# EAGLE design Thermostat Schematic (EAGLE 8.6.0)

## Sheet 1 of 2
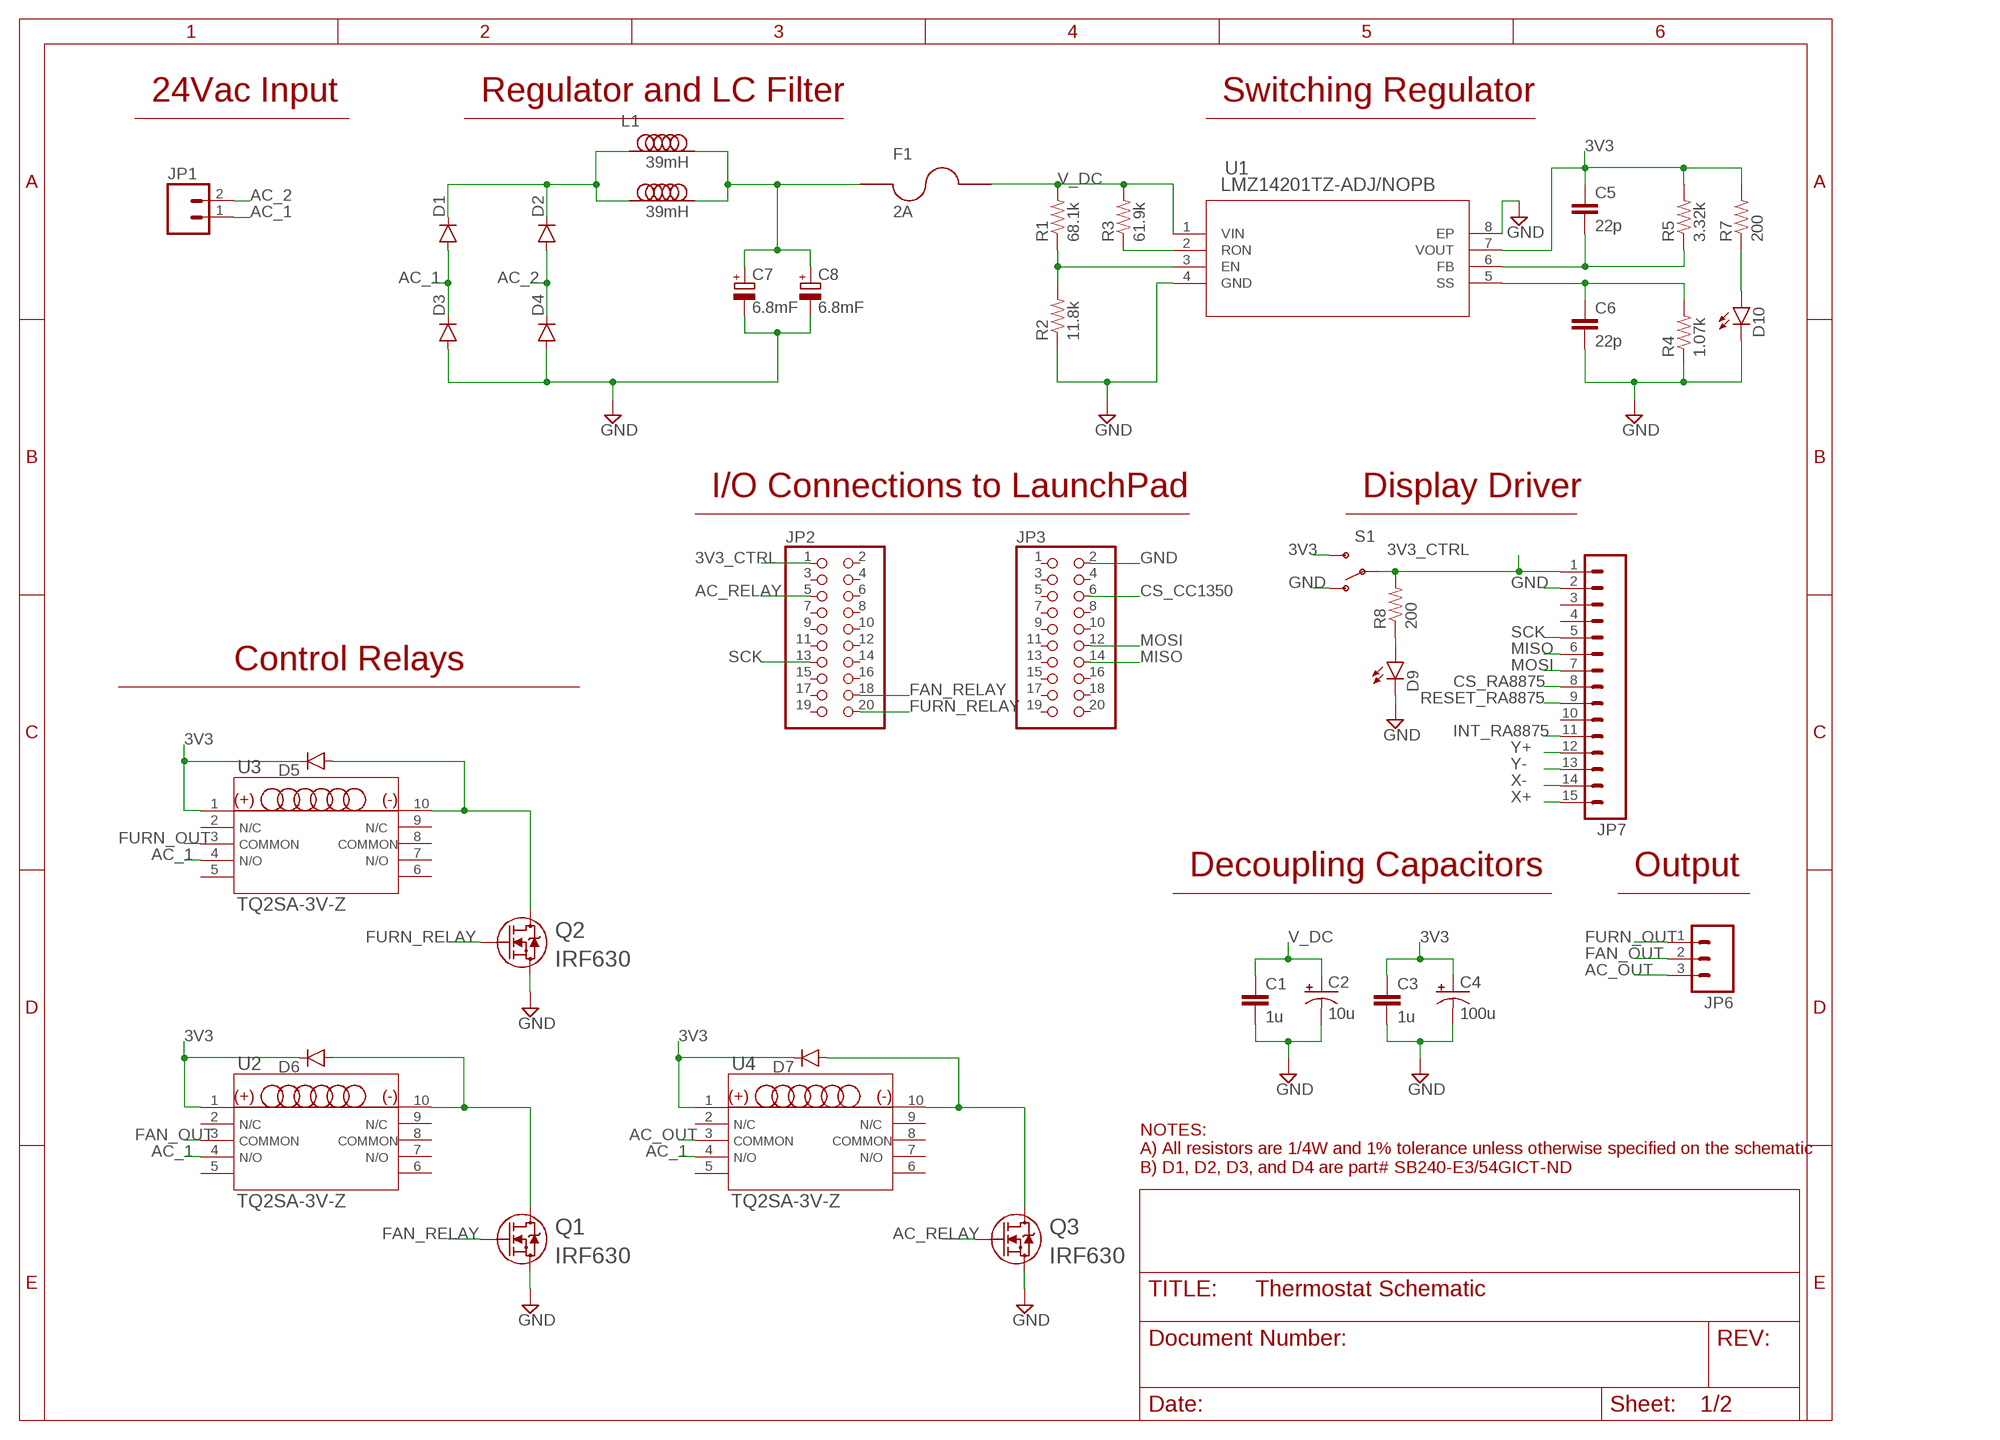
[diagram p0: schematic, sheet 1]

### Parts
C1  1u  CAPPTH1  [CAP-PTH-5MM]
C2  10u  CAP_POLPTH2  [CPOL-RADIAL-10UF-25V]
C3  1u  CAPPTH1  [CAP-PTH-5MM]
C4  100u  CAP_POLPTH4  [CPOL-RADIAL-1000UF-25V]
C5  22p  CAPPTH1  [CAP-PTH-5MM]
C6  22p  CAPPTH1  [CAP-PTH-5MM]
C7  6.8mF  CPOL-EUE7.5-16  [E7,5-16]
C8  6.8mF  CPOL-EUE7.5-16  [E7,5-16]
D1  DIODEPTH  [DIODE-1N4001]
D2  DIODEPTH  [DIODE-1N4001]
D3  DIODEPTH  [DIODE-1N4001]
D4  DIODEPTH  [DIODE-1N4001]
D5  DIODEPTH  [DIODE-1N4001]
D6  DIODEPTH  [DIODE-1N4001]
D7  DIODEPTH  [DIODE-1N4001]
D9  LED1206  [LED-1206]
D10  LED1206  [LED-1206]
F1  2A  FUSEHOLDER_36-3550-2-ND  [36-3550-2-ND]
JP1  M023.5MM  [SCREWTERMINAL-3.5MM-2]
JP2  PINHD-2X10  [2X10]
JP3  PINHD-2X10  [2X10]
JP6  M03SCREW  [SCREWTERMINAL-3.5MM-3]
JP7  M15  [1X15]
L1  39mH  B82733F  [B82733F]
Q1  IRF630  [TO-220]
Q2  IRF630  [TO-220]
Q3  IRF630  [TO-220]
R1  68.1k  RESISTORAXIAL-0.3  [AXIAL-0.3]
R2  11.8k  RESISTORAXIAL-0.3  [AXIAL-0.3]
R3  61.9k  RESISTORAXIAL-0.3  [AXIAL-0.3]
R4  1.07k  RESISTORAXIAL-0.3  [AXIAL-0.3]
R5  3.32k  RESISTORAXIAL-0.3  [AXIAL-0.3]
R7  200  RESISTORAXIAL-0.3  [AXIAL-0.3]
R8  200  RESISTORAXIAL-0.3  [AXIAL-0.3]
S1  SWITCH-SPDTPTH  [SWITCH-SPDT]
U1  LMZ14201TZ-ADJ/NOPB  [TZA07A]
U2  TQ2SA-3V-Z  TQ2SA-3V-ZRELAY_TQ2_SA-M  [RELAY_TQ2_SA-M]
U3  TQ2SA-3V-Z  TQ2SA-3V-ZRELAY_TQ2_SA-M  [RELAY_TQ2_SA-M]
U4  TQ2SA-3V-Z  TQ2SA-3V-ZRELAY_TQ2_SA-M  [RELAY_TQ2_SA-M]

### Nets
3V3: C3.1 C4.+ C5.1 D5.C D6.C D7.C R5.P$2 R7.P$2 S1.3(S) U1.7(VOUT) U2.1 U3.1 U4.1 ; also sheet 2
3V3_CTRL: JP2.1 JP7.1 R8.P$2 S1.2(P)
AC_1: D1.A D3.C JP1.1 U2.4 U3.4 U4.4
AC_2: D2.A D4.C JP1.2
AC_OUT: JP6.3 U4.3
AC_RELAY: JP2.5 Q3.1
CS_CC1350: JP3.6 ; also sheet 2
CS_RA8875: JP7.8 ; also sheet 2
FAN_OUT: JP6.2 U2.3
FAN_RELAY: JP2.18 Q1.1
FURN_OUT: JP6.1 U3.3
FURN_RELAY: JP2.20 Q2.1
GND: C1.2 C2.2(-) C3.2 C4.- C6.2 C7.- C8.- D3.A D4.A D9.C D10.C JP3.2 JP7.2 Q1.3 Q2.3 Q3.3 R2.P$1 R4.P$1 S1.1(O) U1.4(GND) U1.8(EP) ; also sheet 2
INT_RA8875: JP7.11 ; also sheet 2
MISO: JP3.14 JP7.6 ; also sheet 2
MOSI: JP3.12 JP7.7 ; also sheet 2
N$1: R1.P$1 R2.P$2 U1.3(EN)
N$2: R3.P$1 U1.2(RON)
N$3: C5.2 R5.P$1 U1.6(FB)
N$4: C6.1 R4.P$2 U1.5(SS)
N$5: D9.A R8.P$1
N$6: D1.C D2.C L1.P$1 L1.P$4
N$7: C7.+ C8.+ F1.PIN1A(PIN1) F1.PIN1B(PIN1) L1.P$2 L1.P$3
N$8: D10.A R7.P$1
N$9: D5.A Q2.2 U3.10
N$10: D6.A Q1.2 U2.10
N$11: D7.A Q3.2 U4.10
RESET_RA8875: JP7.9 ; also sheet 2
SCK: JP2.13 JP7.5 ; also sheet 2
V_DC: C1.1 C2.1(+) F1.PIN2A(PIN2) F1.PIN2B(PIN2) R1.P$2 R3.P$2 U1.1(VIN)
X+: JP7.15 ; also sheet 2
X-: JP7.14 ; also sheet 2
Y+: JP7.12 ; also sheet 2
Y-: JP7.13 ; also sheet 2
Unconnected: JP2.2 JP2.3 JP2.4 JP2.6 JP2.7 JP2.8 JP2.9 JP2.10 JP2.11 JP2.12 JP2.14 JP2.15 JP2.16 JP2.17 JP2.19 JP3.1 JP3.3 JP3.4 JP3.5 JP3.7 JP3.8 JP3.9 JP3.10 JP3.11 JP3.13 JP3.15 JP3.16 JP3.17 JP3.18 JP3.19 JP3.20 JP7.3 JP7.4 JP7.10 U2.2 U2.5 U2.6 U2.7 U2.8 U2.9 U3.2 U3.5 U3.6 U3.7 U3.8 U3.9 U4.2 U4.5 U4.6 U4.7 U4.8 U4.9

### Notes on the sheet
- 24Vac Input | Regulator and LC Filter | Switching Regulator
- I/O Connections to LaunchPad | Display Driver
- Control Relays
- Decoupling Capacitors | Output
- NOTES:
  A) All resistors are 1/4W and 1% tolerance unless otherwise specified on the schematic
  B) D1, D2, D3, and D4 are part# SB240-E3/54GICT-ND

## Sheet 2 of 2
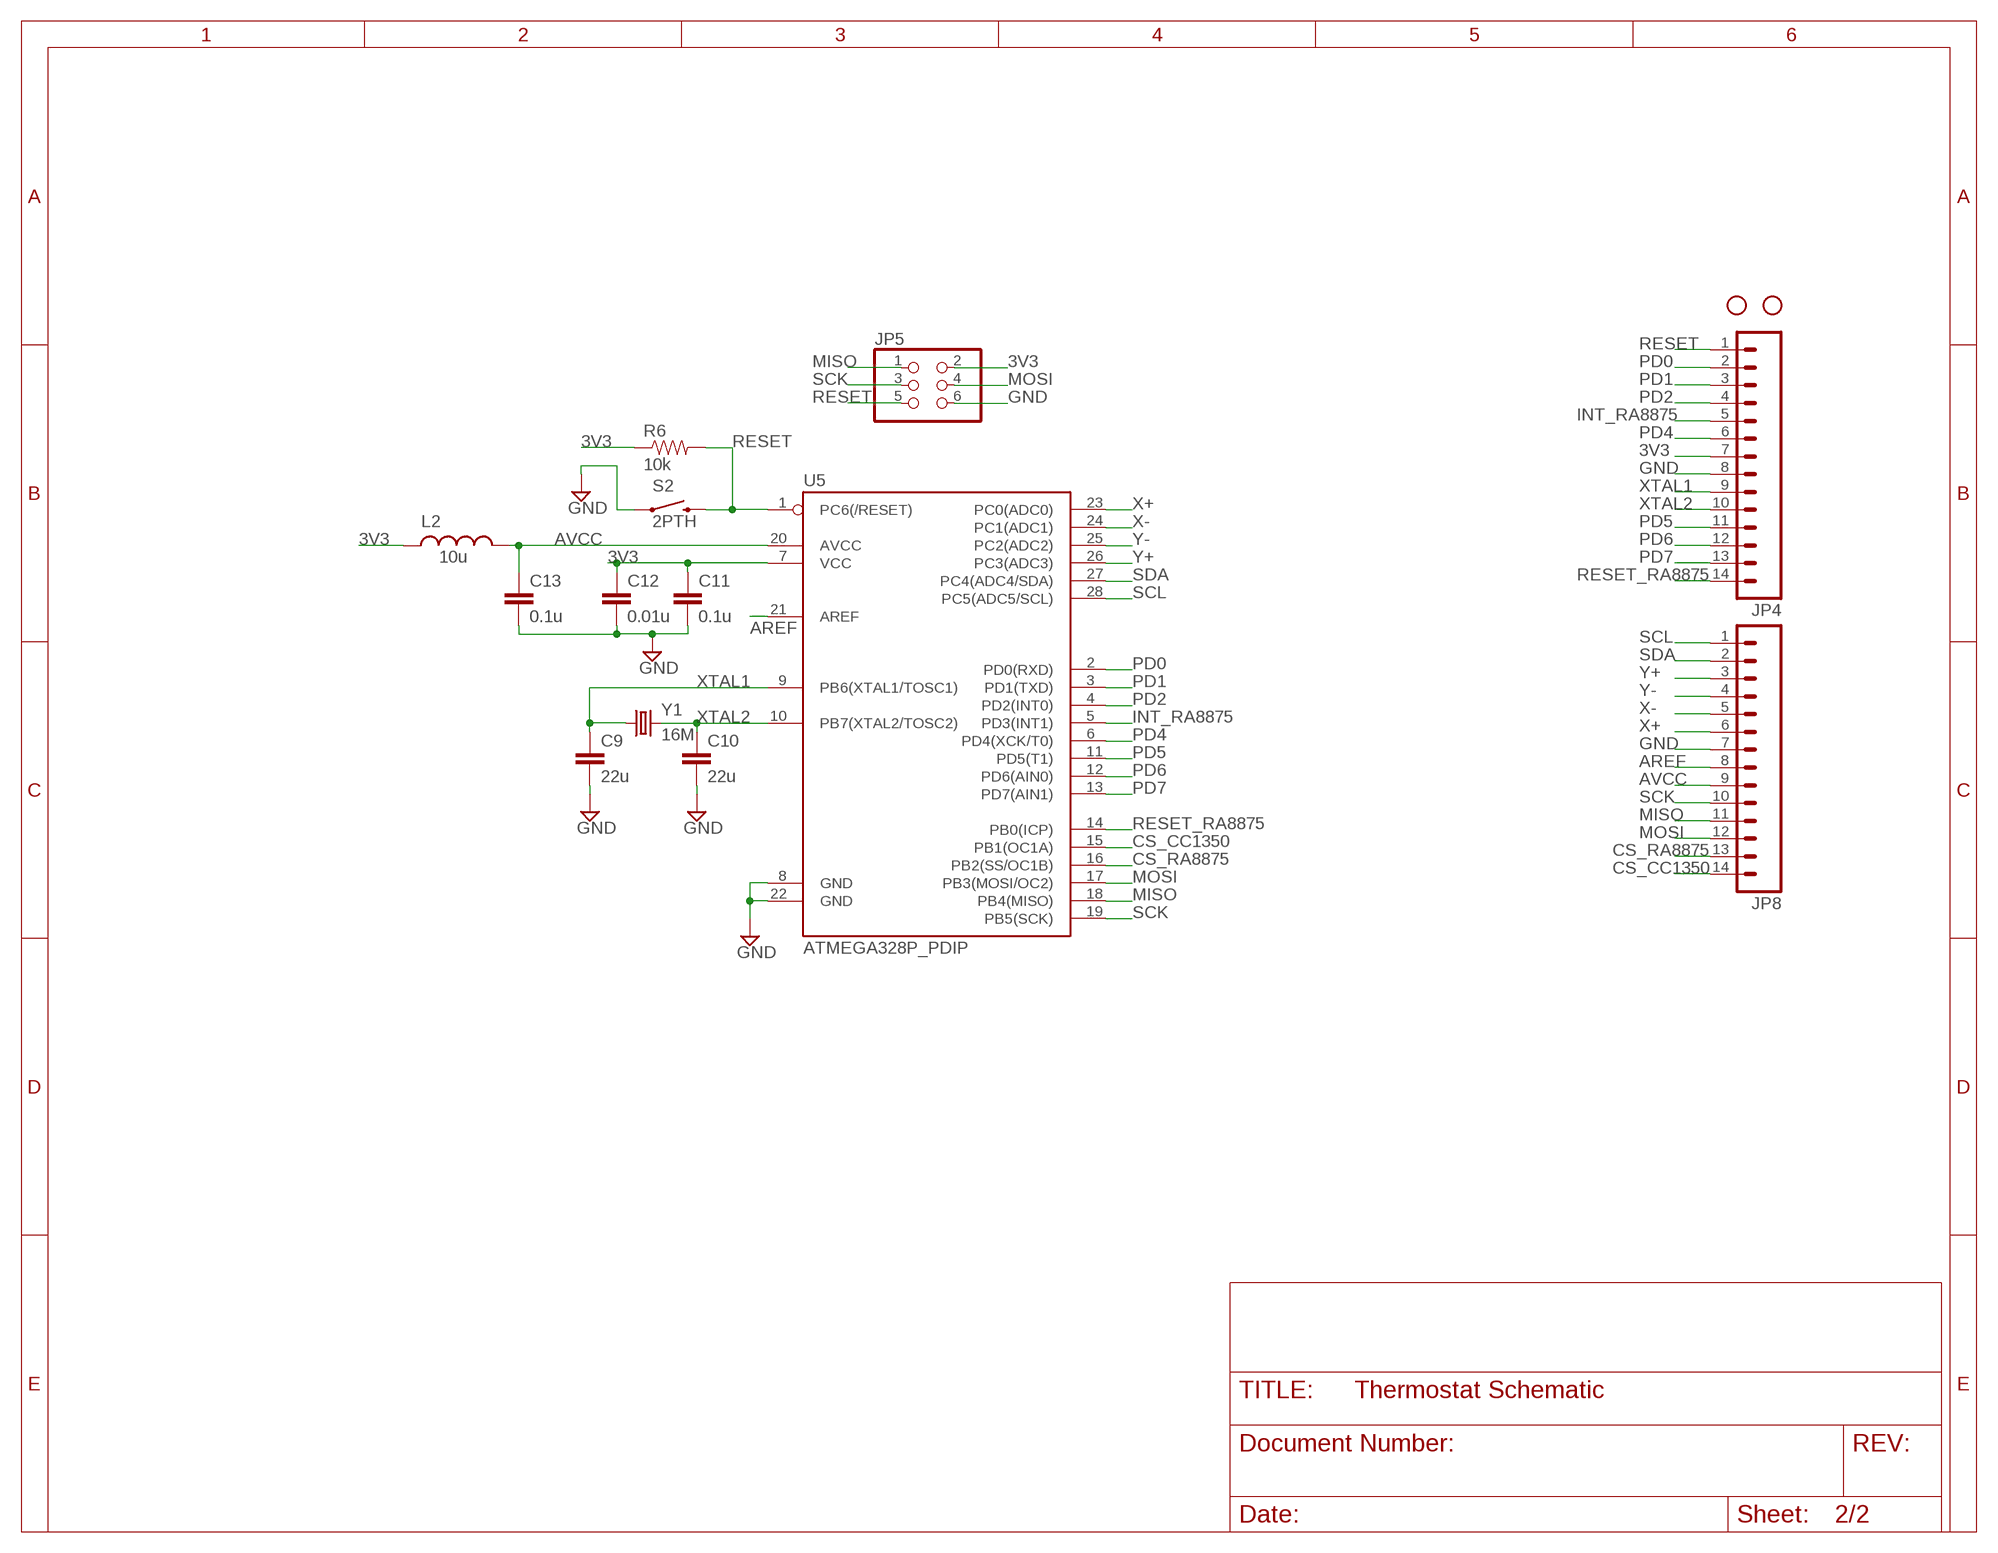
[diagram p1: schematic, sheet 2]

### Parts
C9  22u  CAPPTH1  [CAP-PTH-5MM]
C10  22u  CAPPTH1  [CAP-PTH-5MM]
C11  0.1u  CAPPTH1  [CAP-PTH-5MM]
C12  0.01u  CAPPTH1  [CAP-PTH-5MM]
C13  0.1u  CAPPTH1  [CAP-PTH-5MM]
JP4  M14  [1X14]
JP5  PINHD-2X3  [2X03]
JP8  M14  [1X14]
L2  10u  INDUCTORAXIAL-0.6  [AXIAL-0.6]
R6  10k  RESISTORAXIAL-0.3  [AXIAL-0.3]
S2  2PTH  SWITCH-MOMENTARY-2PTH_EZ  [TACTILE-PTH-EZ]
STANDOFF3  STAND-OFFTIGHT  [STAND-OFF-TIGHT]
STANDOFF4  STAND-OFFTIGHT  [STAND-OFF-TIGHT]
U5  ATMEGA328P_PDIP  [DIL28-3]
Y1  16M  CRYSTALHC49US  [HC49US]

### Nets
3V3: C11.1 C12.1 JP4.7 JP5.2 L2.P$1 R6.P$1 U5.7(VCC) ; also sheet 1
AREF: JP8.8 U5.21(AREF)
AVCC: C13.1 JP8.9 L2.P$2 U5.20(AVCC)
CS_CC1350: JP8.14 U5.15(PB1(OC1A)) ; also sheet 1
CS_RA8875: JP8.13 U5.16(PB2(SS/OC1B)) ; also sheet 1
GND: C9.2 C10.2 C11.2 C12.2 C13.2 JP4.8 JP5.6 JP8.7 S2.1 U5.8(GND) U5.22(GND) ; also sheet 1
INT_RA8875: JP4.5 U5.5(PD3(INT1)) ; also sheet 1
MISO: JP5.1 JP8.11 U5.18(PB4(MISO)) ; also sheet 1
MOSI: JP5.4 JP8.12 U5.17(PB3(MOSI/OC2)) ; also sheet 1
PD0: JP4.2 U5.2(PD0(RXD))
PD1: JP4.3 U5.3(PD1(TXD))
PD2: JP4.4 U5.4(PD2(INT0))
PD4: JP4.6 U5.6(PD4(XCK/T0))
PD5: JP4.11 U5.11(PD5(T1))
PD6: JP4.12 U5.12(PD6(AIN0))
PD7: JP4.13 U5.13(PD7(AIN1))
RESET: JP4.1 JP5.5 R6.P$2 S2.3 U5.1(PC6(/RESET))
RESET_RA8875: JP4.14 U5.14(PB0(ICP)) ; also sheet 1
SCK: JP5.3 JP8.10 U5.19(PB5(SCK)) ; also sheet 1
SCL: JP8.1 U5.28(PC5(ADC5/SCL))
SDA: JP8.2 U5.27(PC4(ADC4/SDA))
X+: JP8.6 U5.23(PC0(ADC0)) ; also sheet 1
X-: JP8.5 U5.24(PC1(ADC1)) ; also sheet 1
XTAL1: C9.1 JP4.9 U5.9(PB6(XTAL1/TOSC1)) Y1.1
XTAL2: C10.1 JP4.10 U5.10(PB7(XTAL2/TOSC2)) Y1.2
Y+: JP8.3 U5.26(PC3(ADC3)) ; also sheet 1
Y-: JP8.4 U5.25(PC2(ADC2)) ; also sheet 1

## Library data of the parts
C1 C3 C5 C6 C9-C13 = SparkFun-Capacitors:CAP: Capacitor Standard 0603 ceramic capacitor, and 0.1" leaded capacitor.
C2 C4 = SparkFun-Capacitors:CAP_POL: Capacitor Polarized These are standard SMD and PTH capacitors. Normally 10uF, 47uF, and 100uF in electrolytic and tantalum varieties. Always verify the external diameter of the through hole cap, it varies with capacity, voltage, and manufacturer. The EIA devices should be standard.
C7 C8 = rcl:CPOL-EU: POLARIZED CAPACITOR, European symbol; SPICEPREFIX: C
D1-D7 = SparkFun-DiscreteSemi:DIODE: Diode These are standard reverse protection diodes and small signal diodes. SMA package can handle up to about 1A. SOD-323 can handle about 200mA. What the SOD-323 package when ordering, there are some mfgs out there that are 5-pin packages.
D9 D10 = SparkFun-LED:LED: LEDs Standard schematic elements and footprints for 5mm, 3mm, 1206, and 0603 sized LEDs. 5mm - Spark Fun Electronics SKU : COM-00529 (and others)
F1 = Blade Fuse Holder:FUSEHOLDER_36-3550-2-ND
JP1 = SparkFun-Connectors:M02: Standard 2-pin 0.1" header. Use with - straight break away headers ( PRT-00116) - right angle break away headers (PRT-00553) - swiss pins (PRT-00743) - machine pins (PRT-00117) - female headers (PRT-00115) Molex polarized connector foot print use with: PRT-08233 with associated crimp pins and housings. 2.54_SCREWTERM for use with PRT-10571. 3.5mm Screw Terminal footprints for PRT-08084 5mm Screw Terminal footprints for use with PRT-08432; PROD_ID: CONN-08399
JP2 JP3 = SparkFun-Connectors:PINHD-2X10: PIN HEADER
JP4 JP8 = SparkFun-Connectors:M14: Header 14 Standard 14-pin 0.1" header. Use with straight break away headers (SKU : PRT-00116), right angle break away headers (PRT-00553), swiss pins (PRT-00743), machine pins (PRT-00117), and female headers (PRT-00115).
JP5 = pinhead:PINHD-2X3: PIN HEADER
JP6 = SparkFun-Connectors:M03: Header 3 Standard 3-pin 0.1" header. Use with straight break away headers (SKU : PRT-00116), right angle break away headers (PRT-00553), swiss pins (PRT-00743), machine pins (PRT-00117), and female headers (PRT-00115). Molex polarized connector foot print use with SKU : PRT-08232 with associated crimp pins and housings.; PROD_ID: CONN-08288
JP7 = SparkFun-Connectors:M15: Header 15 Standard 15-pin 0.1" header. Use with straight break away headers (SKU : PRT-00116), right angle break away headers (PRT-00553), swiss pins (PRT-00743), machine pins (PRT-00117), and female headers (PRT-00115).
L1 = B82733F:B82733F
L2 = SparkFun-Passives:INDUCTOR: Inductors Basic Inductor/Choke - 0603 and 1206. Footprints are not proven and vary greatly between part numbers. INDUCTOR POWER 3.3UH 4.0A SMD 0.197" L x 0.197" W x 0.177" H (5.00mm x 5.00mm x 4.50mm)
Q1-Q3 = NMOS IRF630:IRF630; MANUFACTURER_PART_NUMBER: IRF630; VENDOR: ST Microelectronics
R1-R5 R7 R8 = SparkFun-Resistors:RESISTOR: Resistor Basic schematic elements and footprints for 0603, 1206, and PTH resistors.
R6 = SparkFun-Passives:RESISTOR: Resistor Basic schematic elements and footprints for 0603, 1206, and PTH resistors.
S1 = SparkFun-Electromechanical:SWITCH-SPDT: SPDT Switch Simple slide switch, Spark Fun Electronics SKU : COM-00102 DPDT SMT slide switch, AYZ0202, SWCH-08179; PROD_ID: SWCH-08261
S2 = SparkFun-Electromechanical:SWITCH-MOMENTARY-2: Various NO switches- pushbuttons, reed, etc
STANDOFF3 STANDOFF4 = SparkFun-Electromechanical:STAND-OFF: #4 Stand Off This is the mechanical footprint for a #4 phillips button head screw. Use the keepout ring to avoid running the screw head into surrounding components. SKU : PRT-00447
U1 = LMZ14201TZ Switching Regulator:LMZ14201TZ-ADJ/NOPB; MANUFACTURER_PART_NUMBER: LMZ14201TZADJNOPB; VENDOR: Texas Instruments
U2-U4 = TQ2SA Relay:TQ2SA-3V-Z; MANUFACTURER_PART_NUMBER: TQ2SA3VZ; VENDOR: Panasonic
U5 = SparkFun-DigitalIC:ATMEGA328P_PDIP: uC used in the Arduino 32kb flash, 1k EEPROM, 2k SRAM This is the through-hole version of this chip.
Y1 = SparkFun-FreqCtrl:CRYSTAL: Various standard crystals. Proven footprints.

## Board
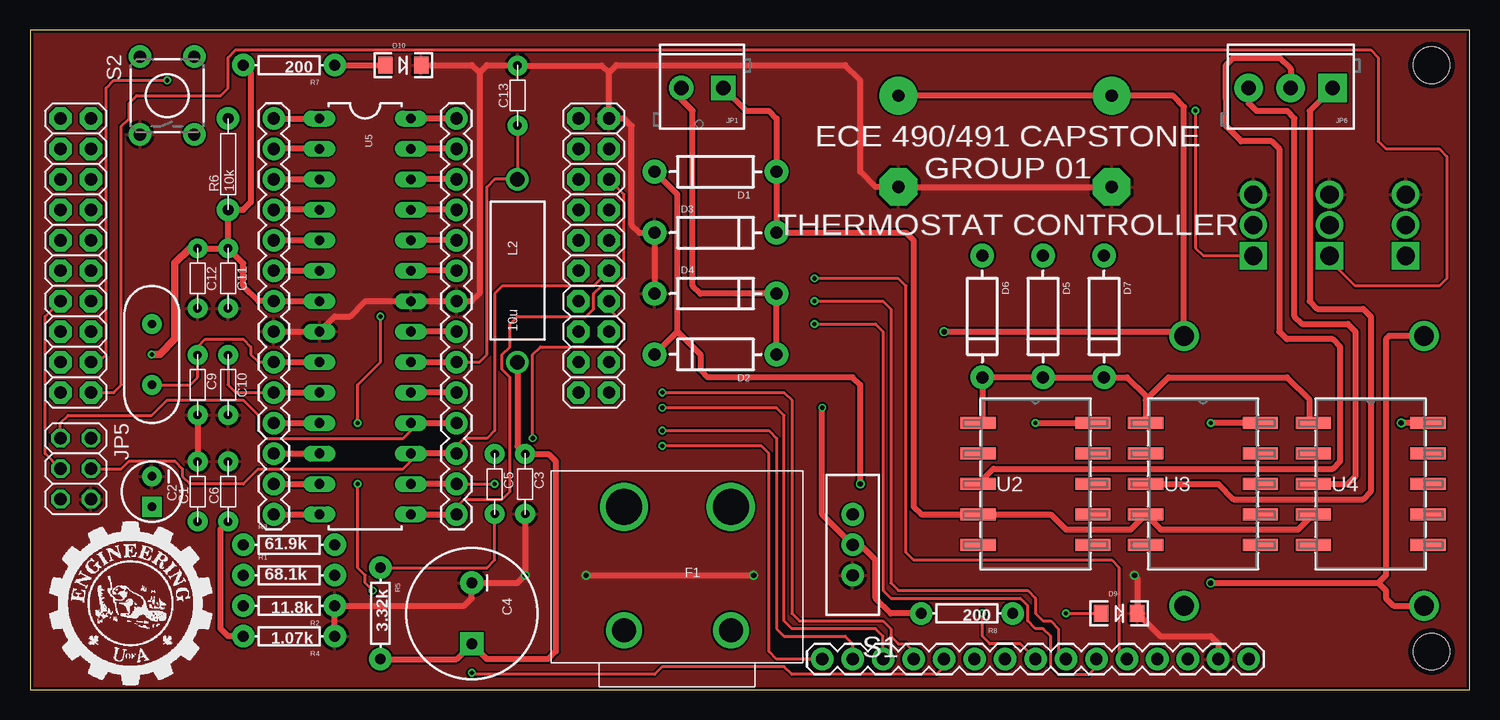
[diagram p2: board, top side]
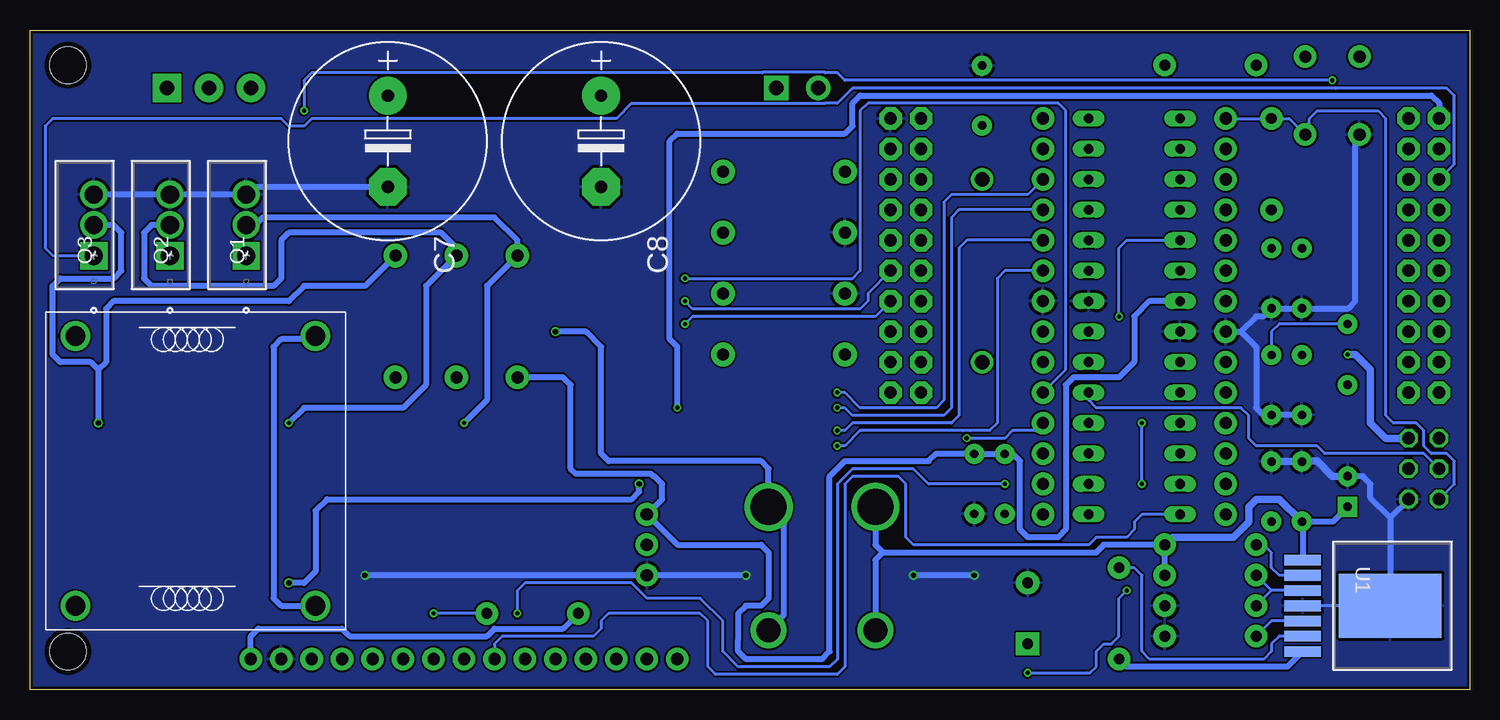
[diagram p3: board, bottom side, seen from below]

Size 120 x 55 mm. Coordinates in mm from the lower left corner, seen from the top.
Outline: 0,0 120,0 120,55 0,55 0,0
Copper layers (1*16): Top 0.035mm / dielectric 1.5mm / Bottom 0.035mm
Design rules "SeeedStudio_2layer_DRU_no_angle_20140221": minimum track width 6mil, minimum drill 12mil, track to track 6mil, track to pad 6mil, pad to pad 6mil, via to via 6mil, smd to smd 0mil, copper to edge 10mil, drill to drill 10mil, minimum pad ring 10mil, minimum via ring 6mil, stop-mask expansion 2mil, vias tented up to drill 100mil, thermal gap 10mil

### Footprints (pad centres in the part's own frame; a part is rotated, then mirrored left to right if it is on the bottom)
CAP-PTH-5MM = drill 0.7 pad 1.651: 1 -2.5,0; 2 2.5,0
CPOL-RADIAL-10UF-25V = drill 0.7 pad 1.651 square: 1 1.27,0 | drill 0.7 pad 1.651: 2 -1.27,0
CPOL-RADIAL-1000UF-25V = drill 0.9 pad 1.93 square: + 2.54,0 | drill 0.9 pad 1.93: - -2.54,0
E7,5-16 = drill 1.016 pad 3.15: + -3.81,0 | drill 1.016 pad 3.15 octagon: - 3.81,0
DIODE-1N4001 = drill 1 pad 1.981: A -5.08,0; C 5.08,0
LED-1206 = smd 1.2 x 1.4: A -1.5,0; C 1.5,0
36-3550-2-ND = drill 2: PIN1A 0,10.3; PIN2A 8.9,10.3 | drill 3: PIN1B 0,0; PIN2B 8.9,0
SCREWTERMINAL-3.5MM-2 = drill 1.2 pad 2.032 square: 1 0,0 | drill 1.2 pad 2.032: 2 3.5,0
2X10 = drill 1.016 pad 1.88 octagon: 1 -11.43,-1.27; 2 -11.43,1.27; 3 -8.89,-1.27; 4 -8.89,1.27; 5 -6.35,-1.27; 6 -6.35,1.27; 7 -3.81,-1.27; 8 -3.81,1.27; 9 -1.27,-1.27; 10 -1.27,1.27; 11 1.27,-1.27; 12 1.27,1.27; 13 3.81,-1.27; 14 3.81,1.27; 15 6.35,-1.27; 16 6.35,1.27; 17 8.89,-1.27; 18 8.89,1.27; 19 11.43,-1.27; 20 11.43,1.27
1X14 = drill 1.016 pad 1.88: 1 0,0; 2 2.54,0; 3 5.08,0; 4 7.62,0; 5 10.16,0; 6 12.7,0; 7 15.24,0; 8 17.78,0; 9 20.32,0; 10 22.86,0; 11 25.4,0; 12 27.94,0; 13 30.48,0; 14 33.02,0
2X03 = drill 1.016 octagon: 1 -2.54,-1.27; 2 -2.54,1.27; 3 0,-1.27; 4 0,1.27; 5 2.54,-1.27; 6 2.54,1.27
SCREWTERMINAL-3.5MM-3 = drill 1.2 pad 2.413 square: 1 0,0 | drill 1.2 pad 2.413: 2 3.5,0; 3 7,0
1X15 = drill 1.016 pad 1.88: 1 0,0; 2 2.54,0; 3 5.08,0; 4 7.62,0; 5 10.16,0; 6 12.7,0; 7 15.24,0; 8 17.78,0; 9 20.32,0; 10 22.86,0; 11 25.4,0; 12 27.94,0; 13 30.48,0; 14 33.02,0; 15 35.56,0
B82733F = drill 1.65: P$1 0,0; P$2 0,-20; P$3 22.5,-20; P$4 22.5,0
AXIAL-0.6 = drill 1.2 pad 1.88: P$1 -7.62,0; P$2 7.62,0
TO-220 = drill 1.524 pad 2.032 square: 1 -5.105,-1.524 | drill 1.524 pad 2.032: 2 -2.54,-1.524; 3 0,-1.524
AXIAL-0.3 = drill 0.9 pad 1.88: P$1 -3.81,0; P$2 3.81,0
SWITCH-SPDT = drill 1.016 pad 1.88: 1 0,2.54; 2 0,0; 3 0,-2.54
TACTILE-PTH-EZ = drill 1.016 pad 1.88: 1 -3.251,2.261; 2 3.251,2.261; 3 -3.251,-2.261; 4 3.251,-2.261
STAND-OFF-TIGHT = hole 3.048: 0,0
TZA07A = smd 0.889 x 3.06: 1 -3.81,-5.025; 2 -2.54,-5.025; 3 -1.27,-5.025; 4 0,-5.025; 5 1.27,-5.025; 6 2.54,-5.025; 7 3.81,-5.025 | smd 5.334 x 8.534: 8 0,2.28
RELAY_TQ2_SA-M = smd 2.94 x 1: 1 -4.78,5.067; 2 -4.78,2.527; 3 -4.78,-0.013; 4 -4.78,-2.553; 5 -4.78,-5.093; 6 4.78,-5.093; 7 4.78,-2.553; 8 4.78,-0.013; 9 4.78,2.527; 10 4.78,5.067
DIL28-3 = drill 0.813 long: 1 -16.51,-3.81; 2 -13.97,-3.81; 3 -11.43,-3.81; 4 -8.89,-3.81; 5 -6.35,-3.81; 6 -3.81,-3.81; 7 -1.27,-3.81; 8 1.27,-3.81; 9 3.81,-3.81; 10 6.35,-3.81; 11 8.89,-3.81; 12 11.43,-3.81; 13 13.97,-3.81; 14 16.51,-3.81; 15 16.51,3.81; 16 13.97,3.81; 17 11.43,3.81; 18 8.89,3.81; 19 6.35,3.81; 20 3.81,3.81; 21 1.27,3.81; 22 -1.27,3.81; 23 -3.81,3.81; 24 -6.35,3.81; 25 -8.89,3.81; 26 -11.43,3.81; 27 -13.97,3.81; 28 -16.51,3.81
HC49US = drill 0.7 pad 1.651: 1 -2.54,0; 2 2.54,0

### Placement (x,y rotation side)
C1  13.97,16.51 90 top
C2  10.16,16.51 270 top
C3  41.27,17.14 270 top
C4  36.83,6.35 270 top
C5  38.73,17.14 270 top
C6  16.51,16.51 90 top
C7  90.17,45.72 270 bottom
C8  72.39,45.72 270 bottom
C9  13.97,25.4 270 top
C10  16.51,25.4 270 top
C11  16.51,34.29 270 top
C12  13.97,34.29 270 top
C13  40.64,49.53 90 top
D1  57.15,43.18 180 top
D2  57.15,27.94 180 top
D3  57.15,38.1 0 top
D4  57.15,33.02 0 top
D5  84.45,31.11 270 top
D6  79.38,31.11 270 top
D7  89.53,31.11 270 top
D9  90.81,6.35 0 top
D10  31.11,52.07 0 top
F1  58.42,15.24 180 top
JP1  57.78,50.16 180 top
JP2  3.81,36.2 270 top
JP3  46.99,36.2 270 top
JP4  20.32,47.62 270 top
JP5  3.81,18.41 270 top
JP6  108.58,50.16 180 top
JP7  101.6,2.54 180 top
JP8  35.56,47.62 270 top
L1  116.2,6.99 90 bottom
L2  40.64,34.92 90 top
Q1  103.5,41.27 90 bottom
Q2  109.86,41.27 90 bottom
Q3  116.2,41.27 90 bottom
R1  21.59,9.53 0 top
R2  21.59,6.99 180 top
R3  21.59,12.06 0 top
R4  21.59,4.45 180 top
R5  29.21,6.35 270 top
R6  16.51,43.81 90 top
R7  21.59,52.07 180 top
R8  78.11,6.35 180 top
S1  68.58,12.06 180 top
S2  11.43,49.53 90 top
STANDOFF3  116.84,3.17 0 top
STANDOFF4  116.84,52.07 0 top
U1  8.89,6.99 270 bottom
U2  83.82,17.14 0 top
U3  97.79,17.14 0 top
U4  111.76,17.14 0 top
U5  27.94,31.11 270 top
U$1  [ENG_LOGO]  1.64,0.38 0 top
Y1  10.16,27.94 90 top

### Tracks (layer width: path | path; a pad name or v marks a point on that pad's centre or on a via)
3V3  (via drill 0.35)
  Top 0.254: U4.1 106.97,22.23 106.68,22.23
  Top 0.508: U5.7 JP4.7 19.05,32.38 17.78,33.66 17.78,35.56 17.74,35.56 C11.1 | R5.P$2 35.56,2.54 C4.+ 38.1,2.54 43.18,2.54 43.81,3.17 43.81,19.05 43.22,19.64 C3.1 40.64,20.28 L2.P$1 | C12.1 C11.1 | R7.P$2 18.41,51.44 18.41,40.64 17.78,40.01 R6.P$1 C11.1 | 93.01,24.13 93.01,24.46 91.44,26.04 D7.C D5.C D6.C 79.38,22.55 U2.1 | 93.01,24.13 U3.1 | 93.01,24.13 94.92,26.04 104.78,26.04 106.68,24.13 106.68,22.23
  Top 0.61: C12.1 13.29,36.79 12.06,35.56 12.06,29.21 10.79,27.94 v10.16,27.94
  Bottom 0.254: 13.97,3.12 U1.7
  Bottom 0.508: U1.7 15.19,1.91 28.57,1.91 R5.P$2 | U5.7 26.67,32.38 27.94,31.11 27.94,27.3 29.21,26.04 33.02,26.04 33.66,25.4 33.66,13.34 34.29,12.7 36.83,12.7 37.47,13.34 37.47,19.05 38.1,19.68 38.14,19.64 C5.1 C3.1 41.31,19.68 44.45,19.68 45.09,19.05 52.07,19.05 53.34,17.78 53.34,3.17 53.98,2.54 60.33,2.54 60.96,3.17 60.96,4.15 60.96,5.73 60.96,6.35 60.33,6.99 59.05,6.99 58.42,7.62 58.42,11.43 59.05,12.06 66.04,12.06 S1.3 67.31,15.88 67.31,17.14 67.94,17.78 68.03,17.78 68.23,17.98 74.5,17.98 74.93,18.41 74.93,25.4 75.56,26.04 D6.C
  Bottom 0.61: JP5.2 6.99,20.95 8.26,22.23 8.26,26.67 9.53,27.94 v10.16,27.94
3V3_CTRL  (via drill 0.35)
  Top 0.508: R8.P$2 71.75,6.35 70.48,7.62 70.48,10.79 69.22,12.06 S1.2 66.04,14.61 v66.04,23.5
  Bottom 0.508: JP7.1 101.6,4.45 100.97,5.08 93.98,5.08 93.34,4.45 81.92,4.45 81.28,5.08 75.56,5.08 R8.P$2 | v66.04,23.5 66.04,28.57 66.67,29.21 66.67,45.72 66.04,46.35 52.07,46.35 51.44,46.99 51.44,48.9 50.8,49.53 3.17,49.53 2.54,48.9 JP2.1
AC_1
  Top 0.508: JP1.1 59.69,48.26 61.59,48.26 62.23,47.62 D1.A D3.C 73.03,38.1 73.66,37.47 73.66,15.24 74.3,14.61 80.01,14.61 80,14.59 U2.4 85.1,14.59 86.36,13.34 91.75,13.34 U3.4 94.27,13.34 105.72,13.34 U4.4
AC_2
  Top 0.508: D2.A D4.C 55.88,33.02 55.24,33.66 55.24,48.26 54.28,49.22 JP1.2
AC_OUT
  Top 0.508: U4.3 109.84,17.13 110.49,17.78 110.49,29.84 109.86,30.48 106.05,30.48 105.41,31.11 105.41,47.62 104.78,48.26 102.23,48.26 101.6,48.9 101.6,50.15 JP6.3
AC_RELAY
  Bottom 0.254: JP2.5 1.27,43.81 1.27,49.53 1.91,50.16 11.13,50.16 11.16,50.14 51.41,50.14 51.44,50.16 52.7,48.9 53.72,48.9 53.75,48.87 69.83,48.87 69.85,48.9 71.12,47.62 96.52,47.62 97.16,46.99 98.42,46.99 99.06,47.62 118.11,47.62 118.75,46.99 118.75,36.83 118.08,36.17 Q3.1
AREF
  Top 0.508: JP8.8 U5.21
AVCC
  Top 0.254: JP8.9 37.47,27.3 38.1,27.94 38.1,41.91 38.73,42.55 L2.P$2 C13.1
  Top 0.508: U5.20 JP8.9
CS_CC1350
  Top 0.254: JP8.14 35.56,15.24 36.2,15.88 39.37,15.88 40.01,16.51 40.01,26.04 39.37,26.67 39.37,27.94 40.01,28.57 40.01,30.48 40.64,31.11 46.35,31.11 46.99,31.75 46.99,33.02 47.68,33.71 48.77,33.71 49.53,34.47 49.53,41.27 JP3.6
  Top 0.508: U5.15 JP8.14
CS_RA8875  (via drill 0.35)
  Top 0.254: U5.16 v38.73,17.14 | JP7.8 82.55,3.81 80.01,3.81 79.38,4.45 v79.38,6.35
  Top 0.508: JP8.13 U5.16
  Bottom 0.254: v38.73,17.14 45.09,17.14 46.35,18.41 51.44,18.41 52.7,17.14 52.7,2.54 53.34,1.91 60.96,1.91 62.23,3.17 62.23,5.71 64.14,7.62 68.58,7.62 69.85,8.89 78.74,8.89 79.38,8.26 v79.38,6.35
FAN_OUT
  Top 0.508: U2.3 80.32,18.41 108.58,18.41 109.22,19.05 109.22,28.57 108.58,29.21 104.78,29.21 104.14,29.84 104.14,45.09 103.5,45.72 100.97,45.72 99.72,46.97 99.72,49.17 99.69,49.19 99.69,52.07 100.33,52.7 104.14,52.7 105.08,51.76 JP6.2
FAN_RELAY  (via drill 0.35)
  Top 0.254: JP2.18 5.71,27.3 6.35,27.94 6.35,50.16 6.99,50.8 v11.43,50.8 | v97.16,48.28 97.16,36.83 97.81,36.17 Q1.1
  Bottom 0.254: v11.43,50.8 52.07,50.8 52.7,51.44 53.72,51.44 53.75,51.46 58.92,51.46 58.94,51.44 96.52,51.44 97.16,50.8 v97.16,48.28
FURN_OUT
  Top 0.508: U3.3 99.07,17.13 100.33,15.88 111.12,15.88 111.76,16.51 111.76,31.11 111.12,31.75 107.31,31.75 106.68,32.38 106.68,48.26 JP6.1
FURN_RELAY
  Top 0.254: JP2.20 6.99,24.77 7.62,25.4 7.62,46.99 8.26,47.62 8.26,48.9 8.89,49.53 15.88,49.53 16.51,50.16 16.51,52.7 17.14,53.34 111.76,53.34 112.39,52.7 112.39,45.72 113.03,45.09 117.47,45.09 118.11,44.45 118.11,34.29 117.47,33.66 110.49,33.66 108.33,35.81 Q2.1
GND  (via drill 0.45)
  Top 0.508: JP4.8 U5.8 25.4,31.11 26.67,31.11 27.94,32.38 U5.22 JP8.7 36.83,32.38 37.47,33.02 37.47,51.44 | R4.P$1 R2.P$1 36.2,6.99 36.83,7.62 C4.- 40.64,8.89 v41.27,9.53 C3.2 | C9.2 C1.2 | 48.26,51.44 47.66,52.03 C13.2 40.6,52.07 38.1,52.07 37.47,51.44 | 48.26,51.44 JP3.2 49.53,47.62 50.16,46.99 50.16,38.73 50.8,38.1 D3.A D4.A | D10.C 36.83,52.07 37.47,51.44 | 48.26,51.44 48.9,52.07 67.94,52.07 69.22,50.8 69.22,43.18 70.48,41.91 C8.- C7.- | v46.35,9.53 v60.33,9.53 | v92.08,9.53 92.31,9.29 D9.C 94.21,4.45 98.42,4.45 99.06,3.81 JP7.2
  Bottom 0.254: U1.8 U1.4
  Bottom 0.508: JP5.6 6.61,14.35 | 6.61,14.35 U1.8 | 6.61,14.35 8.26,15.99 8.26,17.14 8.89,17.78 C2.2 | JP4.8 19.05,29.84 | 19.05,29.84 17.78,28.57 17.78,23.5 17.18,22.9 C10.2 C9.2 | 19.05,29.84 17.78,31.11 17.18,31.11 C11.2 C12.2 10.12,31.79 9.53,32.38 9.53,45.92 S2.1 | v41.27,9.53 v46.35,9.53 | v60.33,9.53 S1.1 v92.08,9.53 | Q3.3 Q2.3 Q1.3 101.35,41.91 C7.-
  Bottom 0.61: C2.2 11.43,17.78 12.7,19.05 13.93,19.05 C1.2 C6.2
  pour Bottom: -0.03,55.27 120.17,55.24 120.02,0 -0.23,-0.1
  pour Top: 0,55.24 120.17,55.24 120.02,0 -0.23,-0.1
INT_RA8875  (via drill 0.35)
  Top 0.254: JP7.11 76.2,1.91 75.56,1.27 63.5,1.27 62.87,1.91 52.7,1.91 52.07,1.27 36.83,1.27 v36.83,1.39 | v28.57,8.26 27.94,8.89 27.94,9.53 27.3,10.16 v27.3,17.14 | v27.3,22.23 27.3,25.4 29.21,27.3 v29.21,31.11
  Top 0.508: JP4.5 U5.5
  Bottom 0.254: v36.83,1.39 31.63,1.39 31.11,1.91 31.11,3.17 30.48,3.81 29.84,3.81 29.21,4.45 29.21,7.62 v28.57,8.26 | v27.3,17.14 v27.3,22.23 | v29.21,31.11 29.21,36.83 28.57,37.47 U5.5
MISO  (via drill 0.35)
  Top 0.254: JP5.1 2.54,22.23 3.17,22.86 10.16,22.86 11.43,24.13 17.78,24.13 19.05,22.86 19.05,21.59 19.68,20.95 31.11,20.95 31.75,21.59 U5.18 | v65.41,30.48 70.48,30.48 71.12,29.84 71.12,8.26 71.75,7.62 82.55,7.62 83.19,6.99 83.19,5.71 83.82,5.08 84.45,5.08 85.09,4.45 85.09,1.91 85.72,1.27 88.27,1.27 88.9,1.91 JP7.6 | v41.91,20.95 41.91,27.94 42.55,28.57 48.9,28.57 49.53,29.21 49.53,30.48 48.26,31.75 JP3.14
  Top 0.508: U5.18 JP8.11
  Bottom 0.254: JP8.11 36.2,21.59 38.1,21.59 38.73,20.95 v41.91,20.95 | JP3.14 49.53,31.11 64.77,31.11 v65.41,30.48
MOSI  (via drill 0.35)
  Top 0.254: JP5.4 7.62,18.41 8.26,19.05 12.06,19.05 12.7,18.41 12.7,17.78 13.34,17.14 17.78,17.14 19,18.36 31.06,18.36 31.75,19.05 U5.17 | JP3.12 46.99,33.66 39.37,33.66 38.73,33.02 38.73,21.59 38.1,20.95 36.2,20.95 35.56,20.32 JP8.12 | v65.41,32.38 71.12,32.38 71.75,31.75 71.75,8.89 72.39,8.26 83.19,8.26 83.82,7.62 83.82,6.35 84.45,5.71 85.09,5.71 85.72,5.08 85.72,3.17 JP7.7
  Top 0.508: JP8.12 U5.17
  Bottom 0.254: JP3.12 50.16,33.02 50.16,32.38 50.8,31.75 64.77,31.75 v65.41,32.38
N$1
  Bottom 0.254: U1.3 16.51,8.26 | 16.51,8.26 R1.P$1 | 16.51,8.26 R2.P$2
N$2
  Bottom 0.254: U1.2 15.88,9.53 16.51,10.16 16.51,11.43 17.14,12.06 R3.P$1
N$3
  Top 0.254: R5.P$1 38.1,10.16 38.73,10.79 C5.2
  Bottom 0.254: U1.6 15.88,4.45 16.51,3.81 16.51,3.17 17.14,2.54 26.67,2.54 27.3,3.17 27.3,9.53 27.94,10.16 R5.P$1
N$4
  Top 0.508: R4.P$2 16.51,4.45 15.88,5.08 15.88,13.38 C6.1
  Bottom 0.254: U1.5 16.51,5.71 R4.P$2
N$5  (via drill 0.35)
  Top 0.254: v86.36,6.35 D9.A
  Bottom 0.254: R8.P$1 v86.36,6.35
N$6  (via drill 0.45)
  Top 0.508: D2.C 53.98,29.84 | 53.98,29.84 53.98,41.27 D1.C | 53.98,29.84 55.88,27.94 55.88,26.67 56.52,26.04 68.58,26.04 69.22,25.4 v69.22,17.14 | L1.P$4 113.31,29.48 113.03,29.21 113.03,9.53 112.39,8.89 | L1.P$1 113.67,6.99 113.03,7.62 113.03,8.26 112.39,8.89 | v98.42,8.89 112.39,8.89
  Bottom 0.508: v69.22,17.14 69.22,16.51 69.85,15.88 95.25,15.88 96.2,14.92 96.2,9.84 97.16,8.89 v98.42,8.89
N$7  (via drill 0.45)
  Top 0.508: C8.+ C7.+ 95.25,49.53 96.2,48.58 L1.P$3 95.84,29.84 v76.2,29.84
  Bottom 0.508: F1.PIN1A 57.15,6.21 57.15,13.97 F1.PIN1B 58.42,18.41 59.05,19.05 71.75,19.05 72.39,19.68 72.39,28.57 73.66,29.84 v76.2,29.84 | L1.P$2 99.06,6.99 99.69,7.62 99.69,28.57 99.06,29.21 96.48,29.21 L1.P$3
N$8
  Top 0.508: R7.P$1 D10.A
N$9  (via drill 0.35)
  Top 0.508: U3.10 102.56,22.23 v98.42,22.23
  Bottom 0.508: v98.42,22.23 97.16,23.5 88.9,23.5 87,25.4 87,33.66 D5.A 84.45,36.83 85.72,38.1 98.42,38.1 99.06,37.47 99.06,34.29 99.69,33.66 109.86,33.66 110.49,34.29 110.49,38.1 109.86,38.73 Q2.2
N$10  (via drill 0.35)
  Top 0.508: v83.82,22.23 83.83,22.21 U2.10
  Bottom 0.508: v83.82,22.23 81.92,24.13 81.92,33.66 D6.A 79.38,37.47 81.28,39.37 100.58,39.37 101.22,38.73 Q1.2
N$11  (via drill 0.45)
  Top 0.508: U4.10 114.31,22.21 v114.3,22.23
  Bottom 0.508: D7.A 92.08,33.66 97.16,33.66 98.42,32.38 113.03,32.38 113.67,31.75 113.67,27.3 114.3,26.67 | 114.3,26.67 114.94,27.3 117.47,27.3 118.11,27.94 118.11,33.66 117.47,34.29 113.03,34.29 112.39,34.92 112.39,38.1 113.03,38.73 Q3.2 | 114.3,26.67 v114.3,22.23
PD0
  Top 0.508: U5.2 JP4.2
PD1
  Top 0.508: JP4.3 U5.3
PD2
  Top 0.508: U5.4 JP4.4
PD4
  Top 0.508: JP4.6 U5.6
PD5
  Top 0.508: JP4.11 U5.11
PD6
  Top 0.508: JP4.12 U5.12
PD7
  Top 0.508: JP4.13 U5.13
RESET
  Top 0.508: JP4.1 U5.1
  Bottom 0.254: JP5.5 1.27,17.14 1.27,19.05 1.91,19.68 3.17,19.68 3.81,20.32 3.81,21.59 4.45,22.23 6.35,22.23 6.99,22.86 6.99,47.62 7.62,48.26 12.7,48.26 13.34,47.62 13.34,46.63 S2.3 15.04,47.62 R6.P$2 JP4.1
RESET_RA8875
  Top 0.508: JP4.14 U5.14
  Bottom 0.254: U5.14 27.3,14.61 27.94,13.97 27.94,13.34 28.57,12.7 31.11,12.7 31.75,12.06 46.35,12.06 46.99,12.7 46.99,17.14 47.62,17.78 51.44,17.78 52.07,17.14 52.07,1.91 52.7,1.27 62.87,1.27 63.5,1.91 63.5,5.71 64.14,6.35 71.75,6.35 72.39,5.71 72.39,5.08 73.03,4.45 80.64,4.45 81.28,3.81 JP7.9
SCK  (via drill 0.35)
  Top 0.254: JP5.3 1.27,19.68 1.27,31.11 JP2.13 | JP7.5 90.81,3.17 90.81,10.16 90.17,10.79 73.66,10.79 73.03,11.43 73.03,33.66 72.39,34.29 v65.41,34.29
  Top 0.508: JP8.10 U5.19
  Bottom 0.254: JP5.3 3.81,19.68 12.06,19.68 12.7,20.32 17.78,20.32 18.41,20.95 18.41,22.86 19.05,23.5 31.11,23.5 31.75,24.13 U5.19 | JP8.10 33.66,26.67 33.66,48.26 34.29,48.9 50.16,48.9 50.8,48.26 50.8,34.92 51.44,34.29 v65.41,34.29
SCL
  Top 0.508: JP8.1 U5.28
SDA
  Top 0.508: JP8.2 U5.27
V_DC
  Bottom 0.508: 13.95,13.99 C1.1 | 13.95,13.99 13.91,13.96 U1.1 | C2.1 11.41,13.99 13.95,13.99 | F1.PIN2B 49.53,12.06 48.9,11.43 | R1.P$2 R3.P$2 30.48,12.06 31.11,11.43 48.9,11.43 | 48.9,11.43 49.53,10.79 F1.PIN2A
  Bottom 0.61: C1.1 15.84,15.88 17.78,15.88 18.41,15.24 18.41,13.97 19.68,12.7 24.77,12.7 R3.P$2
X+  (via drill 0.35)
  Top 0.254: JP7.15 62.23,2.54 61.59,3.17 61.59,19.68 60.96,20.32 v52.7,20.32
  Top 0.508: JP8.6 U5.23
  Bottom 0.254: JP8.6 38.73,34.92 39.37,34.29 39.37,22.23 40.01,21.59 41.62,21.59 41.64,21.61 42.18,21.61 42.2,21.59 50.8,21.59 52.07,20.32 v52.7,20.32
X-  (via drill 0.35)
  Top 0.254: v52.7,21.59 61.59,21.59 62.23,20.95 62.23,5.08 62.87,4.45 67.94,4.45 68.58,3.81 JP7.14
  Top 0.508: JP8.5 U5.24
  Bottom 0.254: JP8.5 41.91,37.47 42.55,36.83 42.55,22.86 43.18,22.23 51.44,22.23 52.07,21.59 v52.7,21.59
XTAL1
  Top 0.254: JP4.9 19.05,27.3 18.41,27.94 18.41,28.57 17.78,29.21 14.61,29.21 13.97,28.57 C9.1 13.97,26.04 13.34,25.4 Y1.1
  Top 0.508: JP4.9 U5.9
XTAL2
  Top 0.254: 20.95,24.77 JP4.10 17.14,24.77 16.51,25.4 C10.1
  Top 0.508: 20.95,24.77 U5.10
  Bottom 0.254: Y1.2 15.88,30.48 16.51,29.84 C10.1
Y+  (via drill 0.35)
  Top 0.254: v52.7,24.77 62.87,24.77 63.5,24.13 63.5,6.35 64.14,5.71 71.12,5.71 71.75,5.08 71.75,4.45 72.39,3.81 73.03,3.81 73.66,3.17 JP7.12
  Top 0.508: JP8.3 U5.26
  Bottom 0.254: JP8.3 36.83,41.27 43.18,41.27 43.81,40.64 43.81,24.13 44.45,23.5 50.8,23.5 52.07,24.77 v52.7,24.77
Y-  (via drill 0.35)
  Top 0.254: JP7.13 71.12,4.45 70.48,5.08 63.5,5.08 62.87,5.71 62.87,22.86 62.23,23.5 v52.7,23.5
  Top 0.508: JP8.4 U5.25
  Bottom 0.254: JP8.4 42.55,40.01 43.18,39.37 43.18,23.5 43.81,22.86 51.44,22.86 52.07,23.5 v52.7,23.5

### Text on the board
tPlace: /Users/RyanGrams/Downloads/ESS_logo_header_retina-3.bmp
tNames: ECE 490/491 CAPSTONE / GROUP 01 | THERMOSTAT CONTROLLER